# EAGLE design L6472V1 (EAGLE 7.5.0)
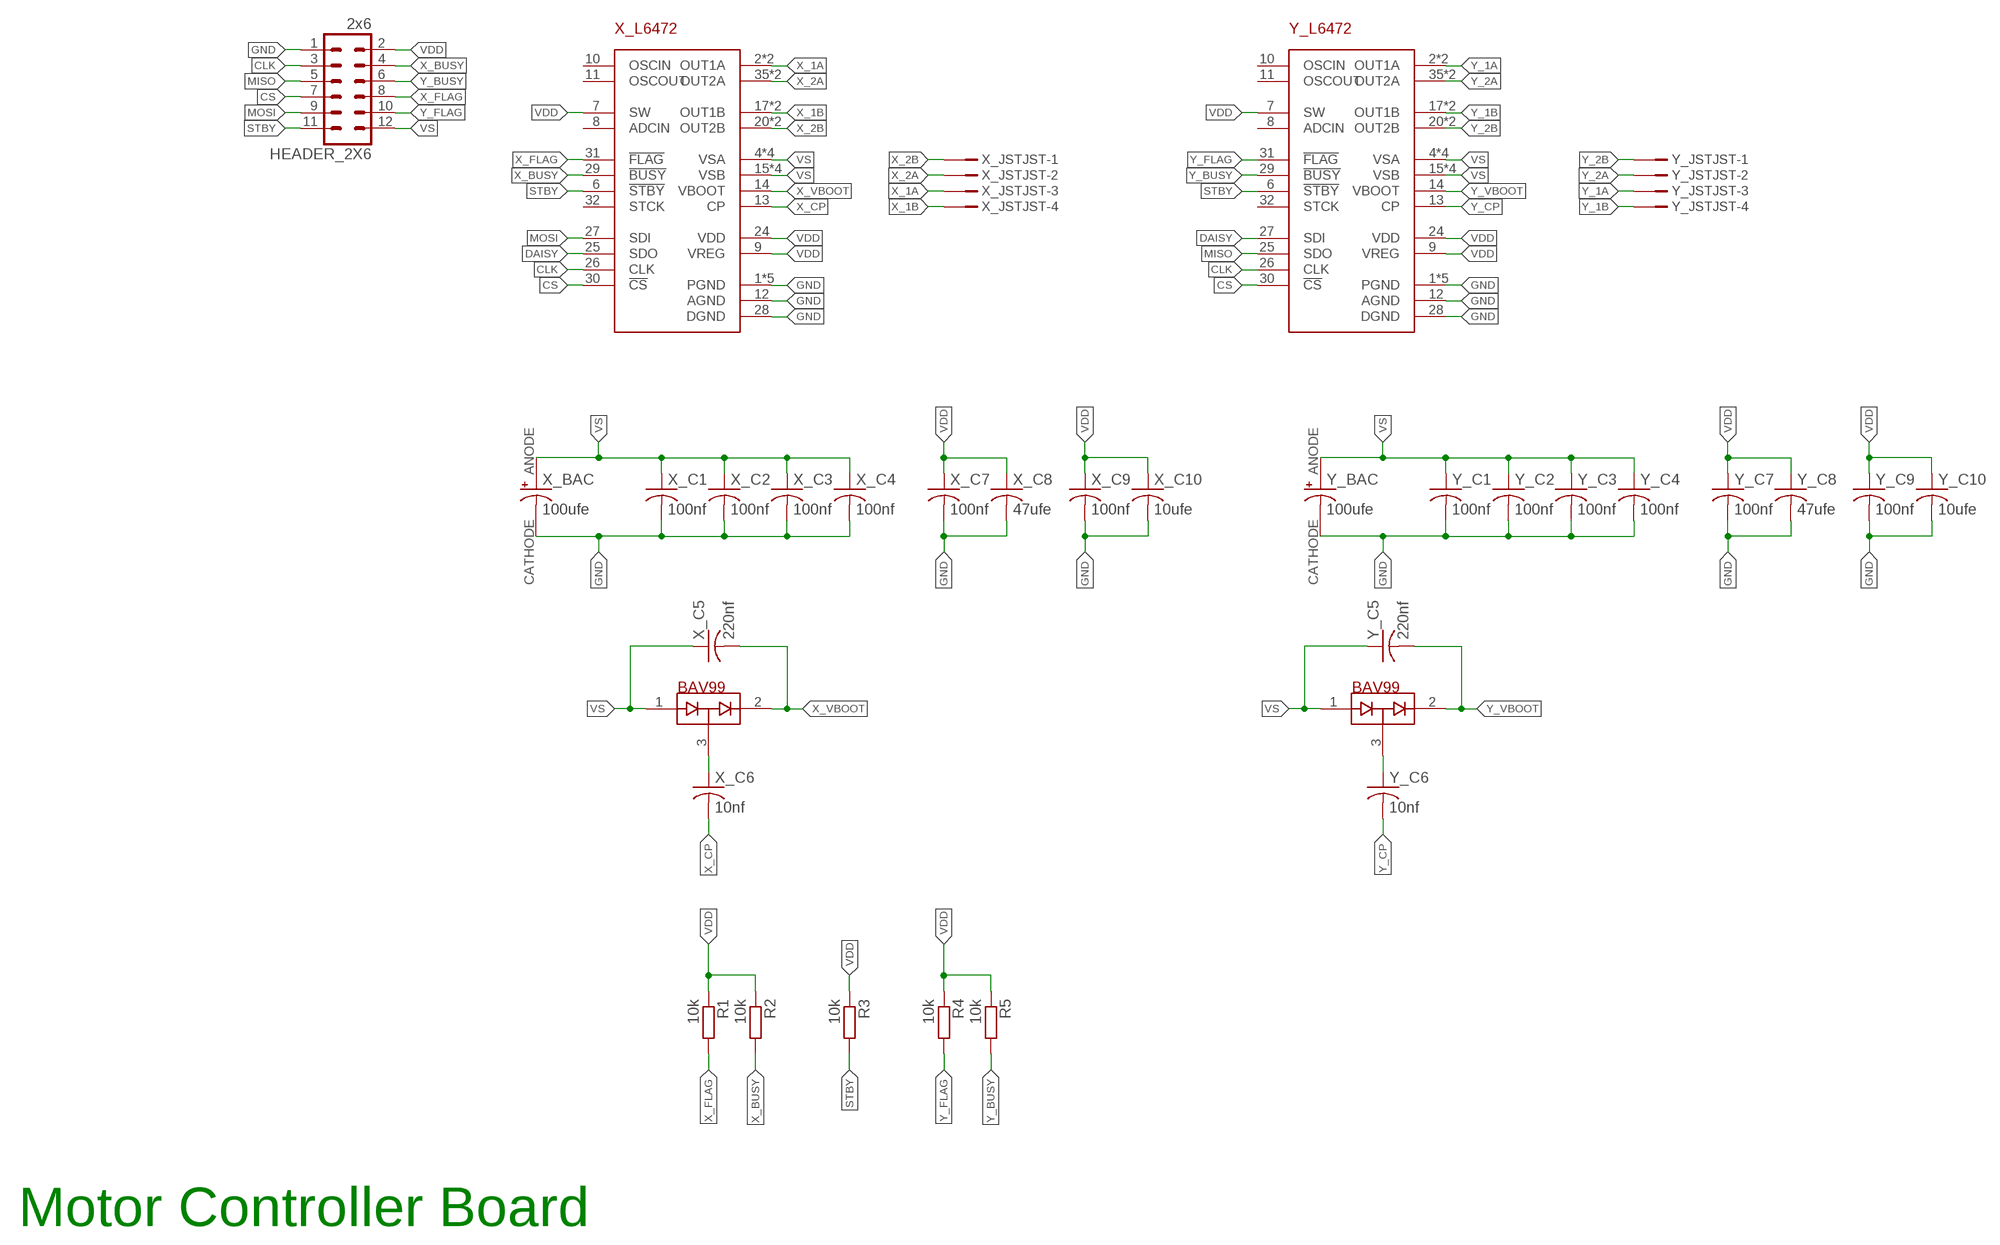
[diagram p0: schematic, sheet 1]

## Parts
HEADER_2X6  2x6  MA06-2  [MA06-2]
R1  10k  R-EU_M1206  [M1206]
R2  10k  R-EU_M1206  [M1206]
R3  10k  R-EU_M1206  [M1206]
R4  10k  R-EU_M1206  [M1206]
R5  10k  R-EU_M1206  [M1206]
X_BAC  100ufe  EEE-1AA101WR  [EEE1AA101WR]
X_BAV99  BAV99  [SOT23_CPL]
X_C1  100nf  C-USC1206  [C1206]
X_C2  100nf  C-USC1206  [C1206]
X_C3  100nf  C-USC1206  [C1206]
X_C4  100nf  C-USC1206  [C1206]
X_C5  220nf  C-USC1206  [C1206]
X_C6  10nf  C-USC1206  [C1206]
X_C7  100nf  C-USC1206  [C1206]
X_C8  47ufe  C-USC1206  [C1206]
X_C9  100nf  C-USC1206  [C1206]
X_C10  10ufe  C-USC1206  [C1206]
X_JST  JST  [JST-4]
X_L6472  L6472  [PSO36]
Y_BAC  100ufe  EEE-1AA101WR  [EEE1AA101WR]
Y_BAV99  BAV99  [SOT23_CPL]
Y_C1  100nf  C-USC1206  [C1206]
Y_C2  100nf  C-USC1206  [C1206]
Y_C3  100nf  C-USC1206  [C1206]
Y_C4  100nf  C-USC1206  [C1206]
Y_C5  220nf  C-USC1206  [C1206]
Y_C6  10nf  C-USC1206  [C1206]
Y_C7  100nf  C-USC1206  [C1206]
Y_C8  47ufe  C-USC1206  [C1206]
Y_C9  100nf  C-USC1206  [C1206]
Y_C10  10ufe  C-USC1206  [C1206]
Y_JST  JST  [JST-4]
Y_L6472  L6472  [PSO36]

## Nets
CLK: HEADER_2X6.3 X_L6472.26(CLK) Y_L6472.26(CLK)
CS: HEADER_2X6.7 X_L6472.30(!CS) Y_L6472.30(!CS)
DAISY: X_L6472.25(SDO) Y_L6472.27(SDI)
GND: HEADER_2X6.1 X_BAC.CATHODE(-) X_C1.2 X_C2.2 X_C3.2 X_C4.2 X_C7.2 X_C8.2 X_C9.2 X_C10.2 X_L6472.1(PGND) X_L6472.12(AGND) X_L6472.19(PGND) X_L6472.28(DGND) X_L6472.M@1(PGND) X_L6472.M@2(PGND) X_L6472.M@3(PGND) Y_BAC.CATHODE(-) Y_C1.2 Y_C2.2 Y_C3.2 Y_C4.2 Y_C7.2 Y_C8.2 Y_C9.2 Y_C10.2 Y_L6472.1(PGND) Y_L6472.12(AGND) Y_L6472.19(PGND) Y_L6472.28(DGND) Y_L6472.M@1(PGND) Y_L6472.M@2(PGND) Y_L6472.M@3(PGND)
MISO: HEADER_2X6.5 Y_L6472.25(SDO)
MOSI: HEADER_2X6.9 X_L6472.27(SDI)
STBY: HEADER_2X6.11 R3.2 X_L6472.6(!STBY) Y_L6472.6(!STBY)
VDD: HEADER_2X6.2 R1.1 R2.1 R3.1 R4.1 R5.1 X_C7.1 X_C8.1 X_C9.1 X_C10.1 X_L6472.7(SW) X_L6472.9(VREG) X_L6472.24(VDD) Y_C7.1 Y_C8.1 Y_C9.1 Y_C10.1 Y_L6472.7(SW) Y_L6472.9(VREG) Y_L6472.24(VDD)
VS: HEADER_2X6.12 X_BAC.ANODE(+) X_BAV99.1(A1) X_C1.1 X_C2.1 X_C3.1 X_C4.1 X_C5.1 X_L6472.4(VSA) X_L6472.5(VSA) X_L6472.15(VSB) X_L6472.16(VSB) X_L6472.22(VSB) X_L6472.23(VSB) X_L6472.33(VSA) X_L6472.34(VSA) Y_BAC.ANODE(+) Y_BAV99.1(A1) Y_C1.1 Y_C2.1 Y_C3.1 Y_C4.1 Y_C5.1 Y_L6472.4(VSA) Y_L6472.5(VSA) Y_L6472.15(VSB) Y_L6472.16(VSB) Y_L6472.22(VSB) Y_L6472.23(VSB) Y_L6472.33(VSA) Y_L6472.34(VSA)
X_1A: X_JST.P2 X_L6472.2(OUT1A) X_L6472.3(OUT1A)
X_1B: X_JST.P3 X_L6472.17(OUT1B) X_L6472.18(OUT1B)
X_2A: X_JST.P1 X_L6472.35(OUT2A) X_L6472.36(OUT2A)
X_2B: X_JST.P0 X_L6472.20(OUT2B) X_L6472.21(OUT2B)
X_BUSY: HEADER_2X6.4 R2.2 X_L6472.29(!BUSY)
X_C1: Y_BAV99.3(COM) Y_C6.1
X_C6: X_BAV99.3(COM) X_C6.1
X_CP: X_C6.2 X_L6472.13(CP)
X_FLAG: HEADER_2X6.8 R1.2 X_L6472.31(!FLAG)
X_VBOOT: X_BAV99.2(C2) X_C5.2 X_L6472.14(VBOOT)
Y_1A: Y_JST.P2 Y_L6472.2(OUT1A) Y_L6472.3(OUT1A)
Y_1B: Y_JST.P3 Y_L6472.17(OUT1B) Y_L6472.18(OUT1B)
Y_2A: Y_JST.P1 Y_L6472.35(OUT2A) Y_L6472.36(OUT2A)
Y_2B: Y_JST.P0 Y_L6472.20(OUT2B) Y_L6472.21(OUT2B)
Y_BUSY: HEADER_2X6.6 R5.2 Y_L6472.29(!BUSY)
Y_CP: Y_C6.2 Y_L6472.13(CP)
Y_FLAG: HEADER_2X6.10 R4.2 Y_L6472.31(!FLAG)
Y_VBOOT: Y_BAV99.2(C2) Y_C5.2 Y_L6472.14(VBOOT)
Unconnected: X_L6472.8(ADCIN) X_L6472.10(OSCIN) X_L6472.11(OSCOUT) X_L6472.32(STCK) Y_L6472.8(ADCIN) Y_L6472.10(OSCIN) Y_L6472.11(OSCOUT) Y_L6472.32(STCK)

## Notes on the sheet
- Motor Controller Board

## Library data of the parts
HEADER_2X6 = con-lstb:MA06-2: PIN HEADER; OC_FARNELL: unknown; OC_NEWARK: unknown
R1-R5 = resistor:R-EU_: RESISTOR, European symbol
X_BAC Y_BAC = L6472LIB:EEE-1AA101WR
X_BAV99 Y_BAV99 = L6472LIB:BAV99: DIODE ARRAY GP 100V 215MA SOT23
X_C1-X_C10 Y_C1-Y_C10 = rcl:C-US: CAPACITOR, American symbol
X_JST Y_JST = L6472LIB:JST
X_L6472 Y_L6472 = L6472LIB:L6472

## Board
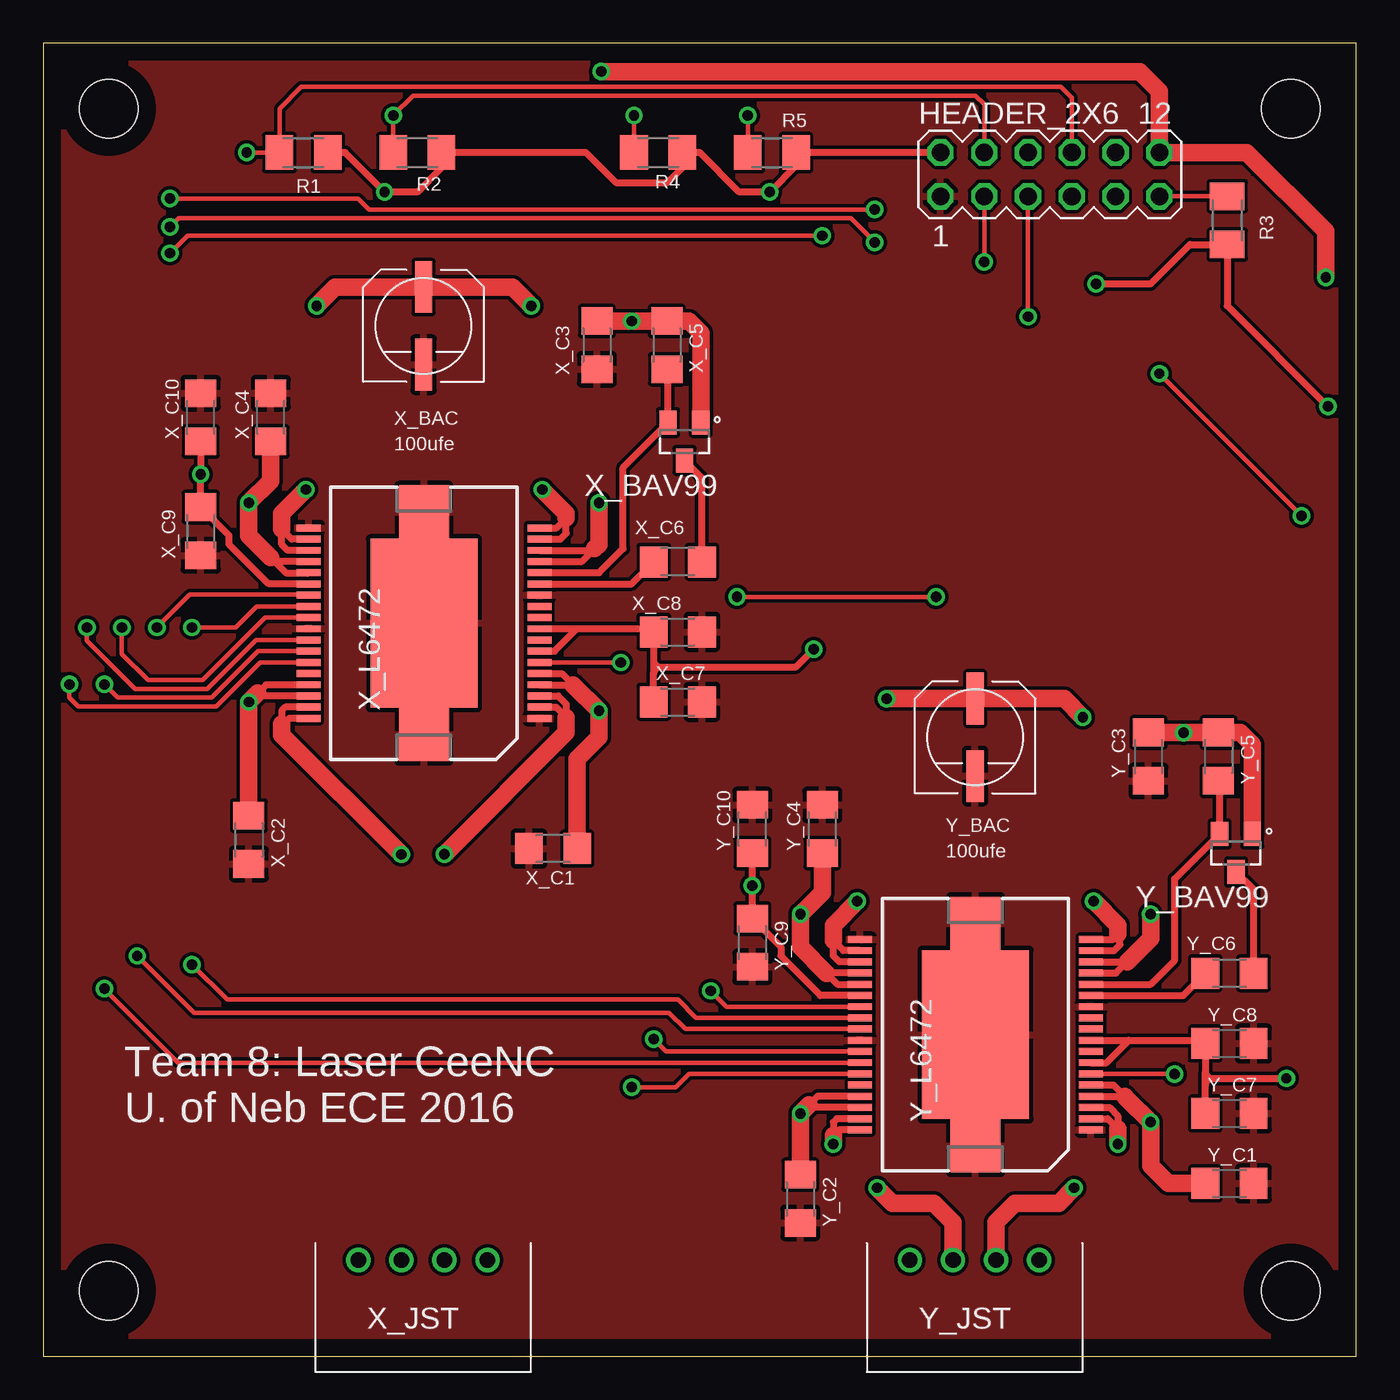
[diagram p1: board, top side]
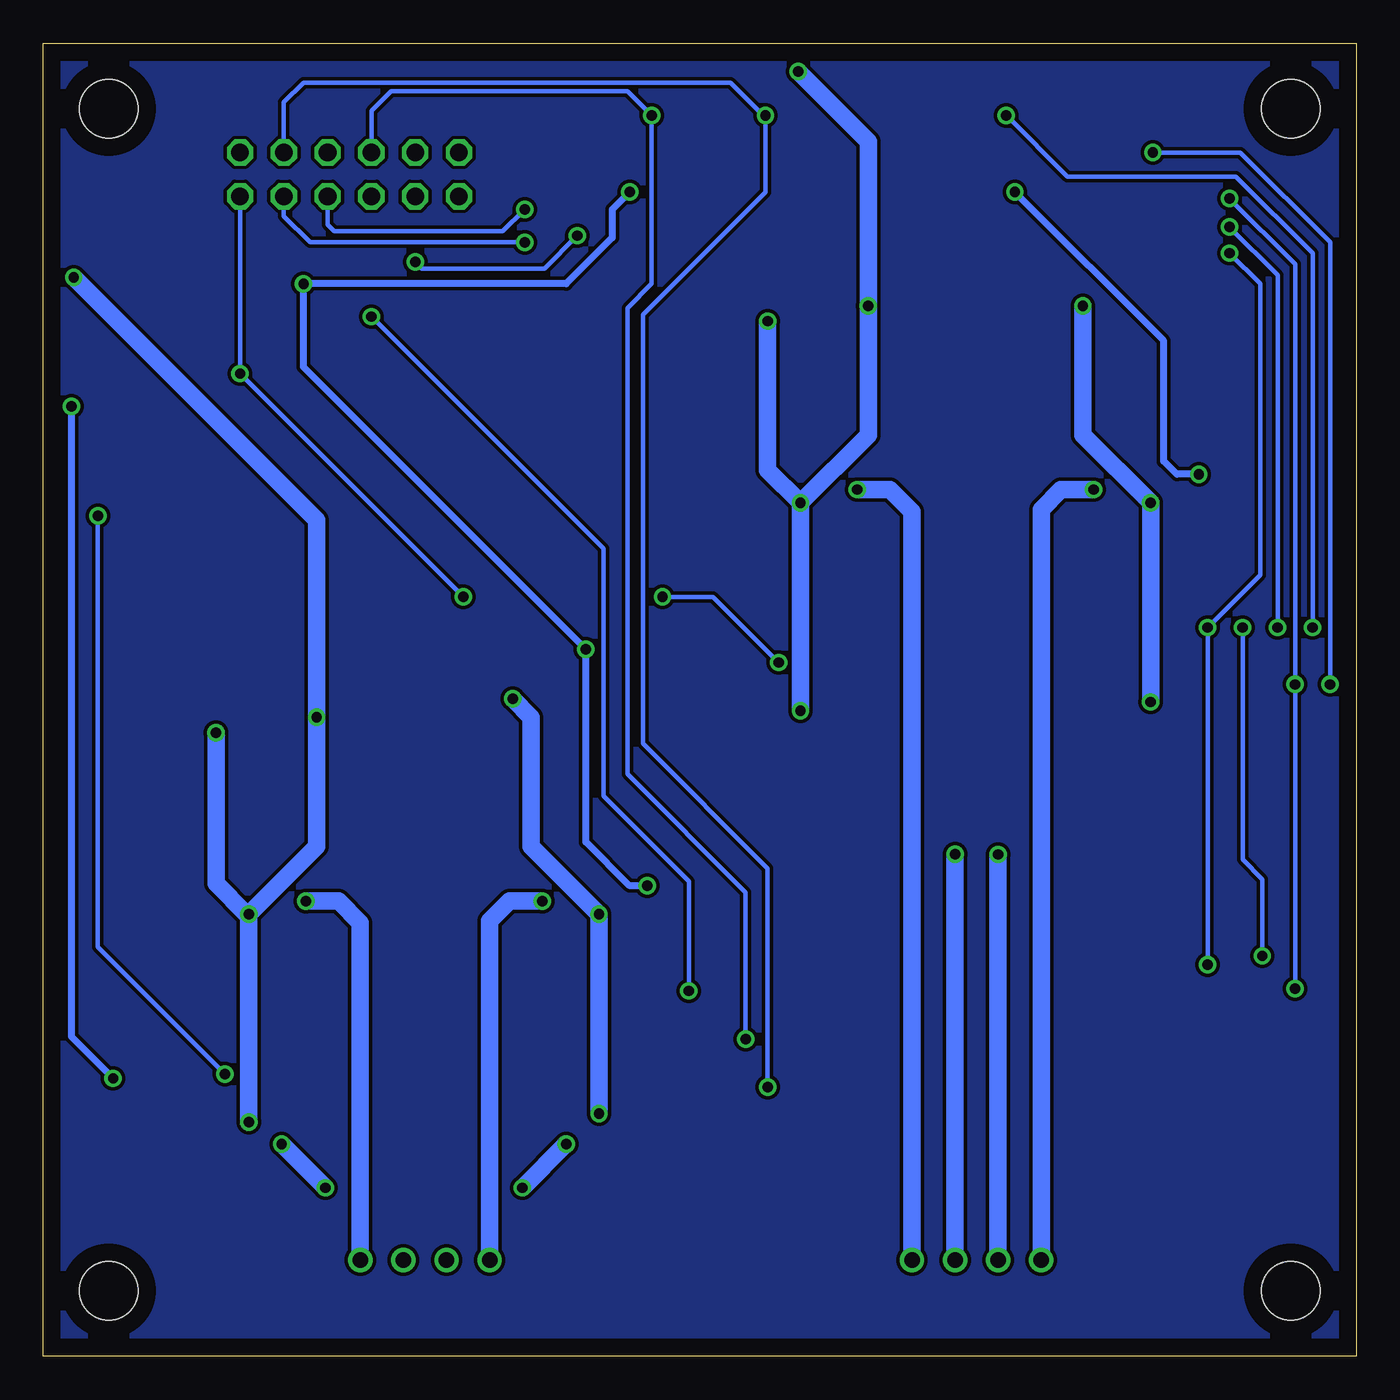
[diagram p2: board, bottom side, seen from below]

Size 76.2 x 76.2 mm. Coordinates in mm from the lower left corner, seen from the top.
Outline: 0,0 76.2,0 76.2,76.2 0,76.2 0,0
Copper layers (1*16): Top 0.035mm / dielectric 1.5mm / Bottom 0.035mm
Design rules "default *": minimum track width 10mil, minimum drill 24mil, track to track 8mil, track to pad 8mil, pad to pad 8mil, via to via 8mil, smd to smd 8mil, copper to edge 40mil, drill to drill 8mil, minimum pad ring 10mil, minimum via ring 8mil, stop-mask expansion 4mil, vias tented up to drill 25mil, thermal gap 10mil
Holes 3.4 mm at 3.81,72.39 72.39,72.39 72.39,3.81 3.81,3.81

### Footprints (pad centres in the part's own frame; a part is rotated, then mirrored left to right if it is on the bottom)
MA06-2 = drill 1.016 octagon: 1 -6.35,-1.27; 2 -6.35,1.27; 3 -3.81,-1.27; 4 -3.81,1.27; 5 -1.27,-1.27; 6 -1.27,1.27; 7 1.27,-1.27; 8 1.27,1.27; 9 3.81,-1.27; 10 3.81,1.27; 11 6.35,-1.27; 12 6.35,1.27
M1206 = smd 1.6 x 2: 1 -1.4,0; 2 1.4,0
EEE1AA101WR = smd 1 x 3: ANODE 1.5,3.5; CATHODE 1.5,-1
SOT23_CPL = smd 1.4 x 1: 1 -1.1,0.95; 2 -1.1,-0.95; 3 1.1,0
C1206 = smd 1.6 x 1.8: 1 -1.4,0; 2 1.4,0
JST-4 = drill 0.9: P0 0,0; P1 2.5,0; P2 5,0; P3 7.5,0
PSO36 = smd 0.4 x 1.4: 1 -5.525,-6.7; 2 -4.875,-6.7; 3 -4.225,-6.7; 4 -3.575,-6.7; 5 -2.925,-6.7; 6 -2.275,-6.7; 7 -1.625,-6.7; 8 -0.975,-6.7; 9 -0.325,-6.7; 10 0.325,-6.7; 11 0.975,-6.7; 12 1.625,-6.7; 13 2.275,-6.7; 14 2.925,-6.7; 15 3.575,-6.7; 16 4.225,-6.7; 17 4.875,-6.7; 18 5.525,-6.7; 19 5.525,6.7; 20 4.875,6.7; 21 4.225,6.7; 22 3.575,6.7; 23 2.925,6.7; 24 2.275,6.7; 25 1.625,6.7; 26 0.975,6.7; 27 0.325,6.7; 28 -0.325,6.7; 29 -0.975,6.7; 30 -1.625,6.7; 31 -2.275,6.7; 32 -2.925,6.7; 33 -3.575,6.7; 34 -4.225,6.7; 35 -4.875,6.7; 36 -5.525,6.7 | smd 9.8 x 6.2: M@1 0,0 | smd 3.1 x 2.9: M@2 -6.45,0; M@3 6.45,0

### Placement (x,y rotation side)
HEADER_2X6  58.42,68.58 0 top
R1  15.11,69.85 180 top
R2  21.72,69.85 180 top
R3  68.71,65.91 90 top
R4  35.69,69.85 180 top
R5  42.29,69.85 180 top
X_BAC  20.57,58.55 0 top
X_BAV99  37.21,53.09 270 top
X_C1  29.59,29.46 180 top
X_C2  11.94,29.97 270 top
X_C3  32.13,58.67 270 top
X_C4  13.21,54.48 90 top
X_C5  36.2,58.67 270 top
X_C6  36.83,46.1 180 top
X_C7  36.83,37.97 0 top
X_C8  36.83,42.04 0 top
X_C9  9.14,47.88 270 top
X_C10  9.14,54.48 90 top
X_JST  18.29,5.59 0 top
X_L6472  22.1,42.55 90 top
Y_BAC  52.58,34.67 0 top
Y_BAV99  69.22,29.21 270 top
Y_C1  68.83,10.03 0 top
Y_C2  43.94,9.14 270 top
Y_C3  64.14,34.8 270 top
Y_C4  45.21,30.61 90 top
Y_C5  68.2,34.8 270 top
Y_C6  68.83,22.23 180 top
Y_C7  68.83,14.1 0 top
Y_C8  68.83,18.16 0 top
Y_C9  41.15,24 270 top
Y_C10  41.15,30.61 90 top
Y_JST  50.29,5.59 0 top
Y_L6472  54.1,18.67 90 top

### Tracks (layer width: path | path; a pad name or v marks a point on that pad's centre or on a via)
CLK  (via drill 0.6)
  Top 0.254: X_L6472.26 12.4,43.52 11.18,42.29 v8.64,42.29 | Y_L6472.26 37.89,19.64 36.83,20.7 10.67,20.7 v8.64,22.73 | HEADER_2X6.3 v54.61,63.5 | v45.21,65.02 8.38,65.02 v7.37,64.01
  Bottom 0.254: v7.37,64.01 5.59,62.23 5.59,45.34 v8.64,42.29 v8.64,22.73 | v54.61,63.5 54.23,63.12 47.12,63.12 v45.21,65.02
CS  (via drill 0.6)
  Top 0.254: X_L6472.30 12.47,40.92 9.78,38.23 4.32,38.23 v3.56,38.99 | v3.56,21.34 7.85,17.04 Y_L6472.30 | v48.26,66.55 18.92,66.55 18.29,67.18 v7.37,67.18
  Bottom 0.254: v7.37,67.18 3.56,63.37 v3.56,38.99 v3.56,21.34 | v48.26,66.55 49.53,65.28 59.31,65.28 59.69,65.66 HEADER_2X6.7
DAISY  (via drill 0.6)
  Top 0.254: X_L6472.25 15.37,44.2 8.51,44.2 v6.6,42.29 | Y_L6472.27 37.27,18.99 36.32,19.94 8.76,19.94 v5.46,23.24
  Bottom 0.254: v6.6,42.29 6.6,28.83 5.46,27.69 v5.46,23.24
GND
  pour Top: -0.38,76.58 -0.38,-0.38 76.58,-0.38 76.58,76.58
MISO  (via drill 0.6, 0.6 pad 0.25)
  Top 0.254: Y_L6472.25 39.65,20.29 v38.73,21.21 | v57.15,60.33 HEADER_2X6.5
  Bottom 0.254: v38.73,21.21 38.73,27.56 43.69,32.51 43.69,46.86 v57.15,60.33
MOSI  (via drill 0.6)
  Top 0.254: X_L6472.27 12.9,42.87 9.27,39.24 6.1,39.24 4.57,40.77 v4.57,42.29 | v48.26,64.64 46.86,66.04 7.87,66.04 v7.37,65.53
  Bottom 0.254: v4.57,42.29 4.57,62.74 v7.37,65.53 | HEADER_2X6.9 62.23,66.17 60.71,64.64 v48.26,64.64
N$1
  Top 0.406: 67.44,15.75 67.44,16.51
N$2
  pour Bottom: -0.25,76.45 76.45,76.45 76.45,-0.25 -0.25,-0.25
STBY  (via drill 0.6)
  Top 0.254: HEADER_2X6.11 67.94,67.31 | v64.77,57.02 v73.03,48.77 | v65.66,16.38 60.81,16.38 Y_L6472.6 | X_L6472.6 33.52,40.27 v33.53,40.26 | v40.26,44.07 v51.82,44.07
  Top 0.406: 67.94,67.31 R3.2
  Bottom 0.254: HEADER_2X6.11 v64.77,57.02 v51.82,44.07 | v73.03,48.77 73.03,23.75 v65.66,16.38 | v40.26,44.07 37.34,44.07 v33.53,40.26
VDD  (via drill 0.6, 0.6 pad 0.25)
  Top 0.254: v9.15,51.18 v9.14,51.18
  Top 0.406: X_L6472.24 13.09,44.82 10.79,47.12 10.79,47.63 X_C9.1 v9.15,51.18 | Y_L6472.24 45.1,20.94 42.8,23.24 42.8,23.75 Y_C9.1 v41.15,27.3 Y_C10.1 | X_L6472.9 30.99,42.22 | 30.99,42.22 35.25,42.22 X_C8.1 35.43,40.26 35.69,40.01 | X_L6472.7 29.69,40.92 30.99,42.22 | Y_L6472.9 62.99,18.34 | 62.99,18.34 67.25,18.34 Y_C8.1 67.43,16.39 67.69,16.13 | Y_L6472.7 61.69,17.04 62.99,18.34 | 67.69,16.13 v72.14,16.13 | Y_C7.1 67.43,15.87 67.69,16.13 | X_C7.1 35.43,39.62 35.43,39.75 | 35.43,39.75 35.69,40.01 | 35.43,39.75 35.43,40.39 | X_C10.1 v9.14,51.18 | R1.1 17.53,69.85 v19.81,67.56 21.72,67.56 23.11,68.96 R2.1 31.5,69.85 33.27,68.07 36.2,68.07 37.09,68.96 R4.1 38.1,69.85 40.39,67.56 v42.16,67.56 43.69,69.09 R5.1 HEADER_2X6.2 | v74.55,55.12 68.71,60.96 R3.1 66.55,64.52 64.26,62.23 v61.09,62.23 | 35.69,40.01 43.69,40.01 v44.7,41.02
  Bottom 0.406: v74.55,55.12 74.55,18.54 v72.14,16.13 | v9.14,51.18 10.41,51.18 11.18,51.94 11.18,58.93 v19.81,67.56 | v41.15,27.3 42.16,27.3 44.7,29.84 v44.7,41.02 61.09,57.4 v61.09,62.23 45.85,62.23 43.18,64.9 43.18,66.55 v42.16,67.56
VS  (via drill 0.6, 0.6 pad 0.25)
  Top 0.406: X_L6472.15 31.26,46.12 31.91,46.77 | Y_L6472.16 62.9,22.89 62.25,22.24 Y_L6472.15 | Y_L6472.4 62.76,15.09 | Y_L6472.5 62.11,15.74 62.87,14.99 | X_L6472.5 30.1,39.62 30.75,38.97 X_L6472.4 | X_L6472.16 31.91,46.77 | 31.91,46.77 32,46.86 | X_L6472.33 12.94,38.97 12.45,38.48 | 13.44,46.12 14.1,45.47 X_L6472.23 | X_L6472.22 13.44,46.12 | 13.44,46.12 13.21,46.35 | Y_L6472.33 44.94,15.09 44.45,14.61 | Y_L6472.23 46.1,21.59 45.47,22.23 45.48,22.24 Y_L6472.22 | Y_L6472.34 44.29,14.44 v43.94,14.1 | X_L6472.34 12.29,38.32 v11.94,37.97
  Top 1.016: v28.32,60.96 27.25,62.03 22.09,62.03 X_BAC.ANODE 22.06,62.03 16.95,62.03 v15.88,60.96 | v60.33,37.08 59.25,38.16 54.09,38.16 Y_BAC.ANODE 54.07,38.16 v48.95,38.16 | 62.9,22.89 64.26,24.26 v64.26,25.65 | 62.76,15.09 62.87,14.99 v64.26,13.59 64.26,11.05 65.28,10.03 Y_C1.1 | 30.75,38.97 v32.26,37.47 32.26,35.94 30.99,34.67 30.99,33.02 X_C1.1 | 32,46.86 32.26,47.12 v32.26,49.53 | 44.45,14.61 v43.94,14.1 Y_C2.1 | 12.45,38.48 v11.94,37.97 X_C2.1 | v74.42,62.61 74.42,65.28 69.85,69.85 HEADER_2X6.12 64.77,73.41 63.63,74.55 v32.38,74.55 | X_C4.1 13.21,50.8 v11.94,49.53 11.94,47.62 13.21,46.35 | 45.47,22.23 43.94,23.75 v43.94,25.65 45.21,26.92 Y_C4.1 | X_C3.1 v34.16,60.07 | v34.16,60.07 | v34.16,60.07 X_C5.1 37.47,60.07 38.16,59.38 X_BAV99.1 | Y_C3.1 v66.16,36.2 | v66.16,36.2 v66.17,36.2 | v66.16,36.2 Y_C5.1 69.47,36.2 70.17,35.5 Y_BAV99.1
  Bottom 1.016: v32.26,49.53 28.32,53.47 v28.32,60.96 28.32,70.48 v32.38,74.55 | v64.26,25.65 60.33,29.59 v60.33,37.08 60.33,48.51 v74.42,62.61 | v64.26,13.59 v64.26,25.65 | v32.26,37.47 v32.26,49.53 | v11.94,37.97 v11.94,49.53 15.88,53.47 v15.88,60.96 | v43.94,14.1 v43.94,25.65 47.88,29.59 47.88,37.08 v48.95,38.16 | v34.16,60.07 34.16,51.44 v32.26,49.53 | v66.17,36.2 66.17,27.43 64.39,25.65 v64.26,25.65
X_1A  (via drill 0.6)
  Top 0.406: X_L6472.2 29.77,37.67 30.35,37.08 30.35,37.85 29.88,38.32 X_L6472.3
  Top 1.016: 30.35,37.08 30.35,36.2 v23.29,29.13
  Bottom 1.016: X_JST.P2 v23.29,29.13
X_1B  (via drill 0.6)
  Top 0.406: X_L6472.18 29.78,48.07 30.35,48.64 30.35,47.75 30.02,47.42 X_L6472.17
  Top 1.016: 30.35,48.64 30.35,48.9 v28.96,50.29
  Bottom 1.016: X_JST.P3 25.79,46.09 | 25.79,46.09 25.78,46.1 | 25.79,46.09 25.79,49.03 27.05,50.29 v28.96,50.29
X_2A  (via drill 0.6)
  Top 0.406: X_L6472.35 14.05,37.67 13.84,37.47 13.84,36.7 | X_L6472.36 14.29,37.02 13.84,36.58
  Top 1.016: 13.84,36.7 13.84,36.58 13.84,36.07 v20.79,29.12
  Bottom 1.016: X_JST.P1 v20.79,29.12
X_2B  (via drill 0.6)
  Top 0.406: X_L6472.20 14.43,47.42 13.84,48.01 13.84,47.12 14.19,46.77 X_L6472.21
  Top 1.016: 13.84,48.01 13.84,48.9 v15.24,50.29
  Bottom 1.016: X_JST.P0 18.29,49.15 17.14,50.29 v15.24,50.29
X_BUSY  (via drill 0.6)
  Top 0.254: HEADER_2X6.4 54.61,72.64 54.1,73.15 21.46,73.15 v20.32,72.01 R2.2 | X_L6472.29 12.36,41.57 9.53,38.73 5.33,38.73 2.54,41.53 v2.54,42.29
  Bottom 0.254: v2.54,42.29 2.54,64.01 6.99,68.45 16.76,68.45 v20.32,72.01
X_C1
  Top 0.406: Y_C6.1 70.23,27.09 Y_BAV99.3
X_C6
  Top 0.406: X_C6.1 38.23,50.97 X_BAV99.3
X_CP
  Top 0.406: X_L6472.13 34.15,44.82 X_C6.2
X_FLAG  (via drill 0.6)
  Top 0.254: v11.81,69.85 R1.2 13.71,72.39 14.98,73.66 59.05,73.66 59.69,73.03 HEADER_2X6.8 | X_L6472.31 12.58,40.27 10.03,37.72 2.03,37.72 1.52,38.23 v1.52,38.99
  Bottom 0.254: v11.81,69.85 6.73,69.85 1.52,64.64 v1.52,38.99
X_VBOOT
  Top 0.406: X_L6472.14 32.26,45.47 33.66,46.86 33.66,51.58 X_BAV99.2 36.26,57.21 X_C5.2
Y_1A  (via drill 0.6)
  Top 0.406: Y_L6472.2 61.77,13.79 62.36,13.21 62.36,13.97 61.88,14.44 Y_L6472.3
  Top 1.016: v62.36,12.32 62.36,13.21 | Y_JST.P2 55.29,7.79 56.39,8.89 58.93,8.89 v59.82,9.78
  Bottom 1.016: v59.82,9.78 v62.36,12.32
Y_1B  (via drill 0.6)
  Top 0.406: Y_L6472.18 62.04,24.19 62.36,24.51 | Y_L6472.17 62.15,23.54 62.48,23.88 62.48,24.89 62.36,25.02
  Top 1.016: 62.36,24.51 62.36,25.02 v60.96,26.42
  Bottom 1.016: Y_JST.P3 57.79,25.15 59.05,26.42 v60.96,26.42
Y_2A  (via drill 0.6)
  Top 0.406: Y_L6472.36 46.16,13.14 45.85,12.83 | Y_L6472.35 46.05,13.79 45.85,13.59 45.85,12.7
  Top 1.016: v45.85,12.32 45.85,12.7 45.85,12.83 | Y_JST.P1 52.79,7.79 51.69,8.89 49.28,8.89 v48.39,9.78
  Bottom 1.016: v48.39,9.78 v45.85,12.32
Y_2B  (via drill 0.6)
  Top 0.406: Y_L6472.21 46.19,22.89 45.85,23.24 45.85,24 45.91,24.07 | Y_L6472.20 46.43,23.54 45.91,24.07 | 45.91,24.07 45.85,24.13
  Top 1.016: 45.85,24.13 45.85,25.02 v47.24,26.42
  Bottom 1.016: Y_JST.P0 50.29,25.27 49.15,26.42 v47.24,26.42
Y_BUSY  (via drill 0.6)
  Top 0.254: R5.2 v40.89,72.01 | Y_L6472.29 36.15,17.69 v35.43,18.41
  Bottom 0.254: HEADER_2X6.6 57.15,72.26 56.01,73.41 42.29,73.41 v40.89,72.01 40.89,62.23 42.29,60.83 42.29,33.78 35.43,26.92 v35.43,18.41
Y_CP
  Top 0.406: Y_L6472.13 66.15,20.94 Y_C6.2
Y_FLAG  (via drill 0.6 pad 0.25)
  Top 0.254: R4.2 v34.29,72.01 | v34.16,15.62 36.7,15.62 37.47,16.38 Y_L6472.31
  Bottom 0.254: HEADER_2X6.10 62.23,72.77 61.09,73.91 36.32,73.91 34.42,72.01 v34.29,72.01 34.29,67.56 41.4,60.45 41.4,35.56 34.16,28.32 v34.16,15.62
Y_VBOOT
  Top 0.406: Y_C5.2 68.27,33.33 Y_BAV99.2 65.66,27.7 65.66,22.99 64.27,21.59 Y_L6472.14

### Text on the board
tPlace: Team 8: Laser CeeNC / U. of Neb ECE 2016